# Altium schematic sheet doantk.SchDoc
size 594 x 420 mm; Engineer: Nguyen Quang Minh; SheetNumber: 1; SheetTotal: 1; Time: currentDate
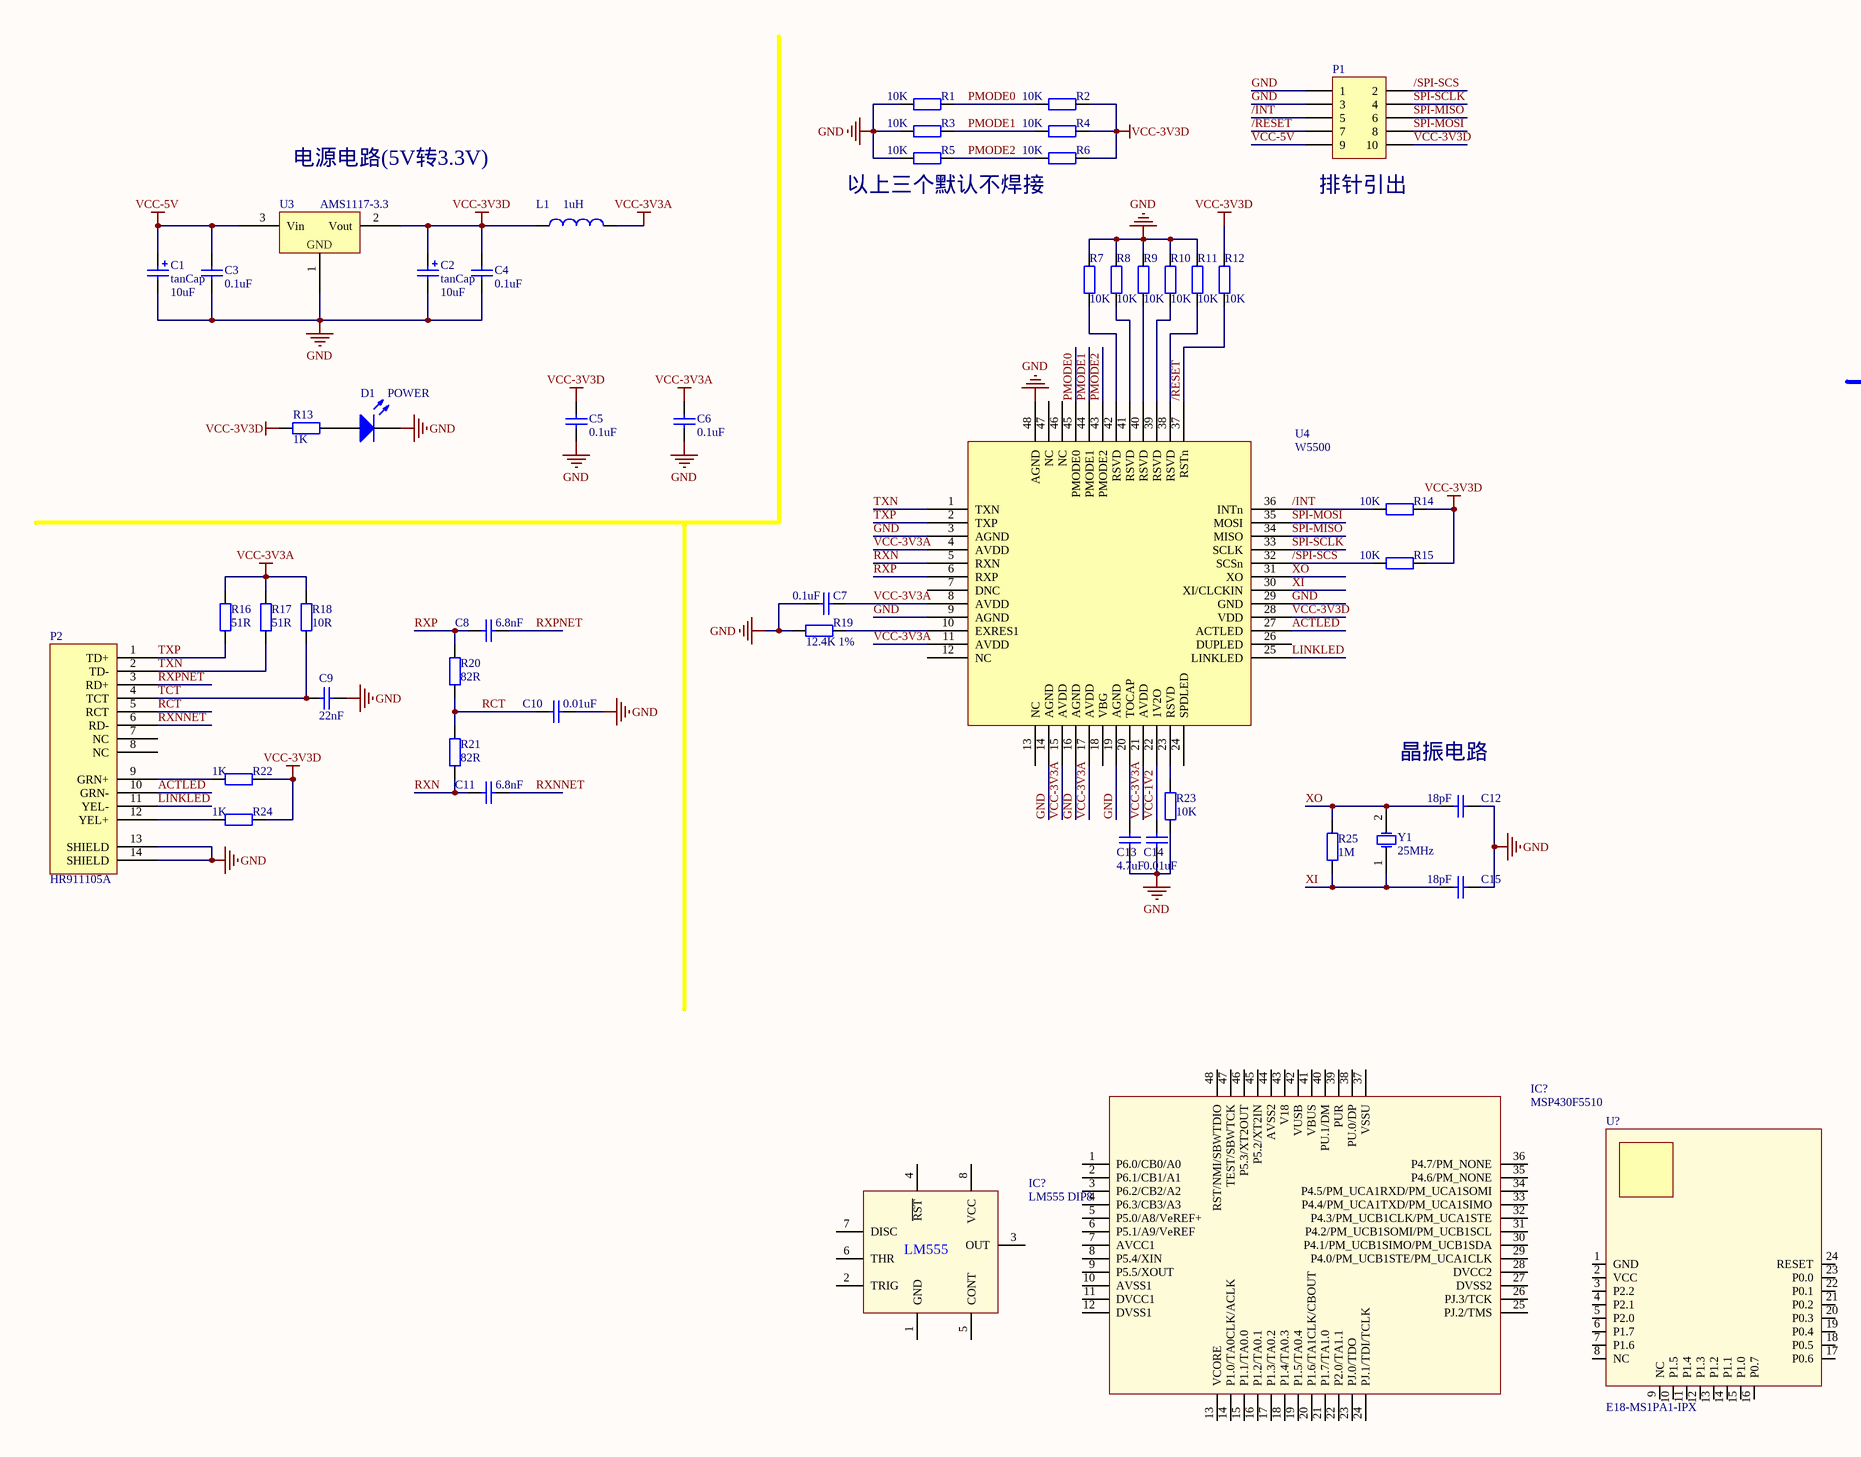
[diagram p0: doantk.SchDoc, left]
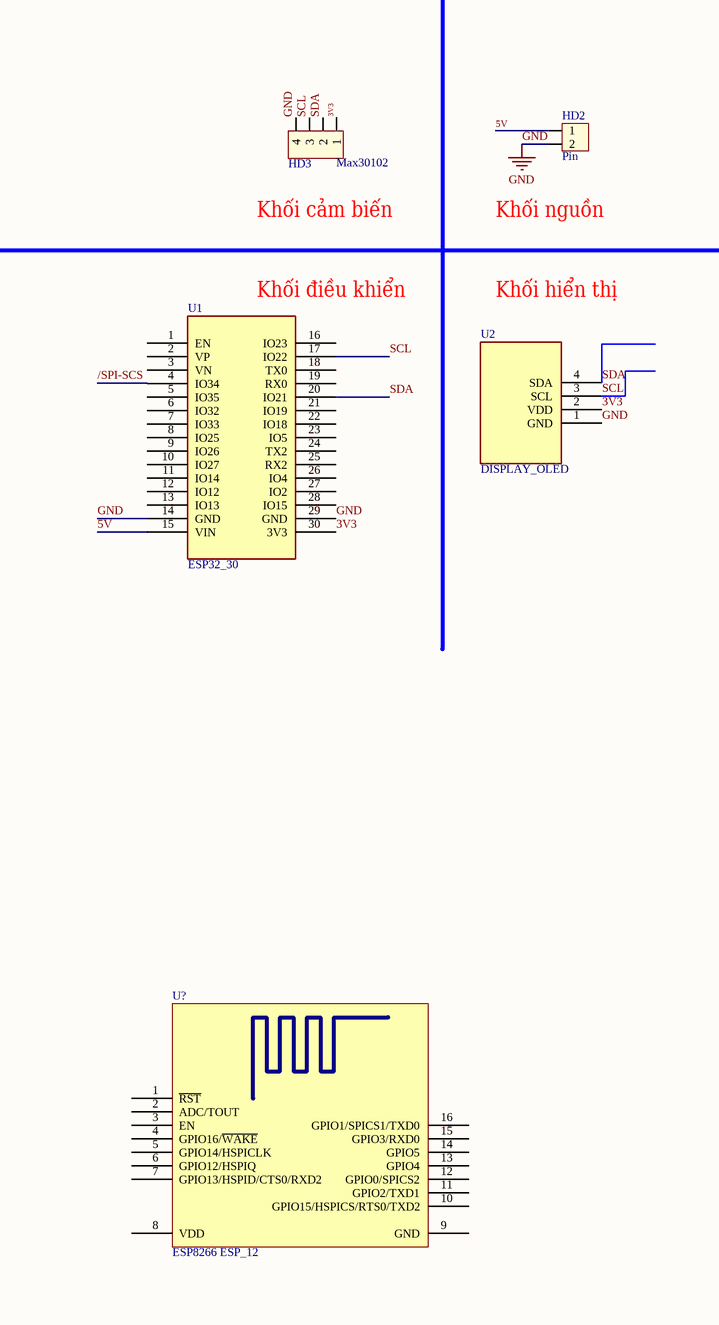
[diagram p1: doantk.SchDoc, right]

## Parts
(Parts that share a designator on the sheet are numbered #1, #2 ... from top to bottom, then left to right.)
C1  tanCap  value 10uF  [C1206]
C2  tanCap  value 10uF  [C1206]
C3  value 0.1uF  [C0805]  (hidden comment: Cap)
C4  value 0.1uF  [C0805]  (hidden comment: Cap)
C5  value 0.1uF  [C0805]  (hidden comment: Cap)
C6  value 0.1uF  [C0805]  (hidden comment: Cap)
C7  value 0.1uF  [C0805]  (hidden comment: Cap)
C8  value 6.8nF  [C0805]  (hidden comment: Cap)
C9  value 22nF  [C0805]  (hidden comment: Cap)
C10  value 0.01uF  [C0805]  (hidden comment: Cap)
C11  value 6.8nF  [C0805]  (hidden comment: Cap)
C12  value 18pF  [C0805]  (hidden comment: Cap)
C13  value 4.7uF  [C0805]  (hidden comment: Cap)
C14  value 0.01uF  [C0805]  (hidden comment: Cap)
C15  value 18pF  [C0805]  (hidden comment: Cap)
D1  POWER  [C0805]
HD2  Pin  [HED2]
HD3  Max30102  [HED4]
IC?#1  LM555 DIP8
IC?#2  MSP430F5510  [MSP430F5510]
L1  value 1uH  [C0805]  (hidden comment: Inductor)
P1  排针引出  [HDR2X5]
P2  HR911105A  [HR911105A]
R1  value 10K  [C0805]  (hidden comment: Res2)
R2  value 10K  [C0805]  (hidden comment: Res2)
R3  value 10K  [C0805]  (hidden comment: Res2)
R4  value 10K  [C0805]  (hidden comment: Res2)
R5  value 10K  [C0805]  (hidden comment: Res2)
R6  value 10K  [C0805]  (hidden comment: Res2)
R7  value 10K  [C0805]  (hidden comment: Res2)
R8  value 10K  [C0805]  (hidden comment: Res2)
R9  value 10K  [C0805]  (hidden comment: Res2)
R10  value 10K  [C0805]  (hidden comment: Res2)
R11  value 10K  [C0805]  (hidden comment: Res2)
R12  value 10K  [C0805]  (hidden comment: Res2)
R13  value 1K  [C0805]  (hidden comment: Res2)
R14  value 10K  [C0805]  (hidden comment: Res2)
R15  value 10K  [C0805]  (hidden comment: Res2)
R16  value 51R  [C0805]  (hidden comment: Res2)
R17  value 51R  [C0805]  (hidden comment: Res2)
R18  value 10R  [C0805]  (hidden comment: Res2)
R19  value 12.4K 1%  [C0805]  (hidden comment: Res2)
R20  value 82R  [C0805]  (hidden comment: Res2)
R21  value 82R  [C0805]  (hidden comment: Res2)
R22  value 1K  [C0805]  (hidden comment: Res2)
R23  value 10K  [C0805]  (hidden comment: Res2)
R24  value 1K  [C0805]  (hidden comment: Res2)
R25  value 1M  [C0805]  (hidden comment: Res2)
U1  ESP32_30  [ESP32_30]
U2  DISPLAY_OLED  [DISPLAY_OLED]
U3  AMS1117-3.3  [SOT223_M]
U4  W5500  [LQFP48]
U?#1  E18-MS1PA1-IPX  [E18-MS1PA1-IPX]
U?#2  ESP8266 ESP_12  [ESP8266 ESP_12]
Y1  25MHz  [XTAL-HC49]

## Nets
GND: C1.2 C2.2 C3.2 C4.2 C5.2 C6.1 C7.2 C9.2 C10.1 C12.1 C13.2 C14.2 C15.1 D1.2(K) HD2.2 HD3.4 P1.1 P1.3 P2.13(SHIELD) P2.14(SHIELD) R1.1 R3.1 R5.1 R7.2 R8.2 R9.2 R10.2 R11.2 R19.1 R23.1 U1.14(GND) U1.29(GND) U2.1(GND) U3.1(GND) U4.3(AGND) U4.9(AGND) U4.14(AGND) U4.16(AGND) U4.19(AGND) U4.29(GND) U4.48(AGND)
VCC-3V3A: C6.2 C7.1 L1.2 R16.1 R17.1 R18.1 U4.4(AVDD) U4.8(AVDD) U4.11(AVDD) U4.15(AVDD) U4.17(AVDD) U4.21(AVDD)
VCC-3V3D: C2.1 C4.1 C5.1 L1.1 P1.10 R2.2 R4.2 R6.2 R12.2 R13.2 R14.2 R15.2 R22.1 R24.1 U3.2(Vout) U4.28(VDD)
VCC-5V: C1.1 C3.1 P1.9 U3.3(Vin)
3V3: HD3.1 U1.30(3V3) U2.2(VDD)
5V: HD2.1 U1.15(VIN)
/INT: P1.5 R14.1 U4.36(INTn)
/RESET: P1.7 R12.1 U4.37(RSTn)
/SPI-SCS: P1.2 R15.1 U1.4(IO34) U4.32(SCSn)
ACTLED: P2.10(GRN-) U4.27(ACTLED)
LINKLED: P2.11(YEL-) U4.25(LINKLED)
PMODE0: R1.2 R2.1 U4.45(PMODE0)
PMODE1: R3.2 R4.1 U4.44(PMODE1)
PMODE2: R5.2 R6.1 U4.43(PMODE2)
RCT: C10.2 P2.5(RCT) R20.1 R21.2
RXN: C11.2 R21.1 U4.5(RXN)
RXNNET: C11.1 P2.6(RD-)
RXP: C8.2 R20.2 U4.6(RXP)
RXPNET: C8.1 P2.3(RD+)
SCL: HD3.3 U1.17(IO22) U2.3(SCL)
SDA: HD3.2 U1.20(IO21) U2.4(SDA)
SPI-MISO: P1.6 U4.34(MISO)
SPI-MOSI: P1.8 U4.35(MOSI)
SPI-SCLK: P1.4 U4.33(SCLK)
TCT: C9.1 P2.4(TCT) R18.2
TXN: P2.2(TD-) R17.2 U4.1(TXN)
TXP: P2.1(TD+) R16.2 U4.2(TXP)
VCC-1V2: C14.1 U4.22(1V2O)
XI: C15.2 R25.1 U4.30(XI/CLCKIN) Y1.1(OSC1)
XO: C12.2 R25.2 U4.31(XO) Y1.2(OSC2)
NetC13_1: C13.1 U4.20(TOCAP)
NetD1_1: D1.1(A) R13.1
NetP2_9: P2.9(GRN+) R22.2
NetP2_12: P2.12(YEL+) R24.2
NetR7_1: R7.1 U4.42(RSVD)
NetR8_1: R8.1 U4.41(RSVD)
NetR9_1: R9.1 U4.40(RSVD)
NetR10_1: R10.1 U4.39(RSVD)
NetR11_1: R11.1 U4.38(RSVD)
NetR19_2: R19.2 U4.10(EXRES1)
NetR23_2: R23.2 U4.23(RSVD)

Not connected (* = marked no-connect by the designer): IC?#1 1(GND) 2(TRIG) 3(OUT) 4(~{RST}) 5(CONT) 6(THR) 7(DISC) 8(VCC); IC?#2 1(P6.0/CB0/A0) 2(P6.1/CB1/A1) 3(P6.2/CB2/A2) 4(P6.3/CB3/A3) 5(P5.0/A8/VeREF+) 6(P5.1/A9/VeREF) 7(AVCC1) 8(P5.4/XIN) 9(P5.5/XOUT) 10(AVSS1) 11(DVCC1) 12(DVSS1) 13(VCORE) 14(P1.0/TA0CLK/ACLK) 15(P1.1/TA0.0) 16(P1.2/TA0.1) 17(P1.3/TA0.2) 18(P1.4/TA0.3) 19(P1.5/TA0.4) 20(P1.6/TA1CLK/CBOUT) 21(P1.7/TA1.0) 22(P2.0/TA1.1) 23(PJ.0/TDO) 24(PJ.1/TDI/TCLK) 25(PJ.2/TMS) 26(PJ.3/TCK) 27(DVSS2) 28(DVCC2) 29(P4.0/PM_UCB1STE/PM_UCA1CLK) 30(P4.1/PM_UCB1SIMO/PM_UCB1SDA) 31(P4.2/PM_UCB1SOMI/PM_UCB1SCL) 32(P4.3/PM_UCB1CLK/PM_UCA1STE) 33(P4.4/PM_UCA1TXD/PM_UCA1SIMO) 34(P4.5/PM_UCA1RXD/PM_UCA1SOMI) 35(P4.6/PM_NONE) 36(P4.7/PM_NONE) 37(VSSU) 38(PU.0/DP) 39(PUR) 40(PU.1/DM) 41(VBUS) 42(VUSB) 43(V18) 44(AVSS2) 45(P5.2/XT2IN) 46(P5.3/XT2OUT) 47(TEST/SBWTCK) 48(RST/NMI/SBWTDIO); P2 7(NC) 8(NC); U1 1(EN) 2(VP) 3(VN) 5(IO35) 6(IO32) 7(IO33) 8(IO25) 9(IO26) 10(IO27) 11(IO14) 12(IO12) 13(IO13) 16(IO23) 18(TX0) 19(RX0) 21(IO19) 22(IO18) 23(IO5) 24(TX2) 25(RX2) 26(IO4) 27(IO2) 28(IO15); U4 7(DNC) 12(NC) 13(NC) 18(VBG) 24(SPDLED) 26(DUPLED) 46(NC) 47(NC); U?#1 1(GND) 2(VCC) 3(P2.2) 4(P2.1) 5(P2.0) 6(P1.7) 7(P1.6) 8(NC) 9(NC) 10(P1.5) 11(P1.4) 12(P1.3) 13(P1.2) 14(P1.1) 15(P1.0) 16(P0.7) 17(P0.6) 18(P0.5) 19(P0.4) 20(P0.3) 21(P0.2) 22(P0.1) 23(P0.0) 24(RESET); U?#2 1(~{RST}) 2(ADC/TOUT) 3(EN) 4(GPIO16/~{WAKE}) 5(GPIO14/HSPICLK) 6(GPIO12/HSPIQ) 7(GPIO13/HSPID/CTS0/RXD2) 8(VDD) 9(GND) 10(GPIO15/HSPICS/RTS0/TXD2) 11(GPIO2/TXD1) 12(GPIO0/SPICS2) 13(GPIO4) 14(GPIO5) 15(GPIO3/RXD0) 16(GPIO1/SPICS1/TXD0)

## Notes on the sheet
- 电源电路(5V转3.3V)
- (near R5) 以上三个默认不焊接
- Khối cảm biến
- Khối nguồn
- (near U1) Khối điều khiển
- Khối hiển thị
- (near C12) 晶振电路
- DWG NO:
- REV:
- THIS DOCUMENT AND THE DATA DISCLOSED HEREIN OR
- HEREWITH IS THE PROPERTY OF ALTIUM LIMITED AND MAY
- BE FREELY DISTRIBUTED IN WHOLE. NO RIGHTS ARE
- RESERVED OR EXPRESS OR IMPLIED WARANTEE GIVEN.
- REVISION
- DESCRIPTION
- DATE
- APPROVED
- ENG:
- APPROVALS
- PROJECT
- DSN:
- CHK:
- REFERENCE DOCUMENTS
- PROJECT REVISION:
- TITLE
- DOCUMENT REVISION:
- DESIGN ITEM:
- BOM:
- FAB DWG:
- PCB DWG:
- ASSY DWG:
- SCALE:
- A2
- SIZE
- CAGE CODE
- FILE NAME
- DWG NO.
- SHEET
- OF
- REV

## Library data of the parts
C1 C2 = Cap Pol2: Polarized Capacitor (Axial); Published: 8-Jun-2000; LatestRevisionDate: 17-Jul-2002; LatestRevisionNote: Re-released for DXP Platform.; PackageReference: POLAR0.8; Publisher: Altium Limited; PackageDescription: Polarized Capacitor; 2 Leads
C3-C15 = Cap: Capacitor; Published: 8-Jun-2000; LatestRevisionDate: 17-Jul-2002; LatestRevisionNote: Re-released for DXP Platform.; PackageReference: RAD-0.3; Publisher: Altium Limited; PackageDescription: Radial Cap, Thru-Hole; 2 Leads; 0.3 in Pin Spacing
D1 = LED0: Typical INFRARED GaAs LED; Published: 8-Jun-2000; LatestRevisionDate: 08-Jul-2005; LatestRevisionNote: Mech Layer 1 removed.; PackageReference: LED-0; Publisher: Altium Limited; PackageDescription: LED; 2 Leads
HD2 = Hed2: Header 2 (Green); Value: Header 2
HD3 = Hed4: Header 4 (Green); Value: Header 4
IC?#1 = LM555: Supplier 1: Mouser; Supplier Part Number 1: 926-LM555CN/NOPB
L1 = Inductor: Code_IEC: 1005; Published: 8-Jun-2000; LatestRevisionDate: 29-May-2009; LatestRevisionNote: IPC-7351 Footprint Added.; PackageReference: 0402-A; Publisher: Altium Limited; PackageDescription: Chip Inductor; Code_JEITA: 0402
P1 = Header 5X2: Header, 5-Pin, Dual row; LatestRevisionDate: 17-Jul-2002; LatestRevisionNote: Re-released for DXP Platform.; Publisher: Altium Limited
P2 = HR911105A: RJ45插座
R1-R25 = Res2: Resistor; Published: 8-Jun-2000; LatestRevisionDate: 17-Jul-2002; LatestRevisionNote: Re-released for DXP Platform.; PackageReference: AXIAL-0.4; Publisher: Altium Limited; PackageDescription: Axial Device, Thru-Hole; 2 Leads; 0.4 in Pin Spacing
U1 = ESP32_30: Microcontoller Board 30 Pins Wifi 2.4GHz BLE 4.2 ESP32-WROOM-32D; ComponentLink1Description: Datasheet; ComponentLink1URL: https://www.mouser.com/datasheet/2/891/esp32_wroom_32d_esp32_wroom_32u_datasheet_en-1365844.pdf
U2 = DISPLAY_OLED: Display Oled 128x64 0.96" I2C.
U3 = AMS1117: AMS1117-
U4 = W5500: W5500以太网芯片
U?#1 = E18-MS1PA1-IPX: E18-MS1PA1-IPXModule Zigbee CC2530 ; Transmitting power, 100mW ; Receiving sensitivity, 250Kbps ; Communication protocal; VNbuylink: *; Digikeybuylink: *
U?#2 = ESP8266 ESP_12: ESP8266 ESP-12; IC: ESP8266-EX; Vendor: Ai-thinker; LatestReviewer: Zion Blue; Published: 14-Apr-2015; Publisher: Cynetik Group; LatestRevisionData: 14-Apr-2015; LatestRevisionNote: Include 3D body and Footprint
Y1 = XTAL: Crystal Oscillator; Published: 8-Jun-2000; LatestRevisionDate: 17-Jul-2002; LatestRevisionNote: Re-released for DXP Platform.; PackageReference: R38; Publisher: Altium Limited; PackageDescription: Crystal, Thru-Hole; 2 Leads; Body 3.1 x 8.2 mm (Dia.xH)
IC?#2 = MSP430F5510: Supplier 1: Digikey; Supplier Part Number 1: 296-28135-1-ND